# Altium schematic sheet Stm32.SchDoc
size A4; SheetNumber: 2; SheetTotal: 8
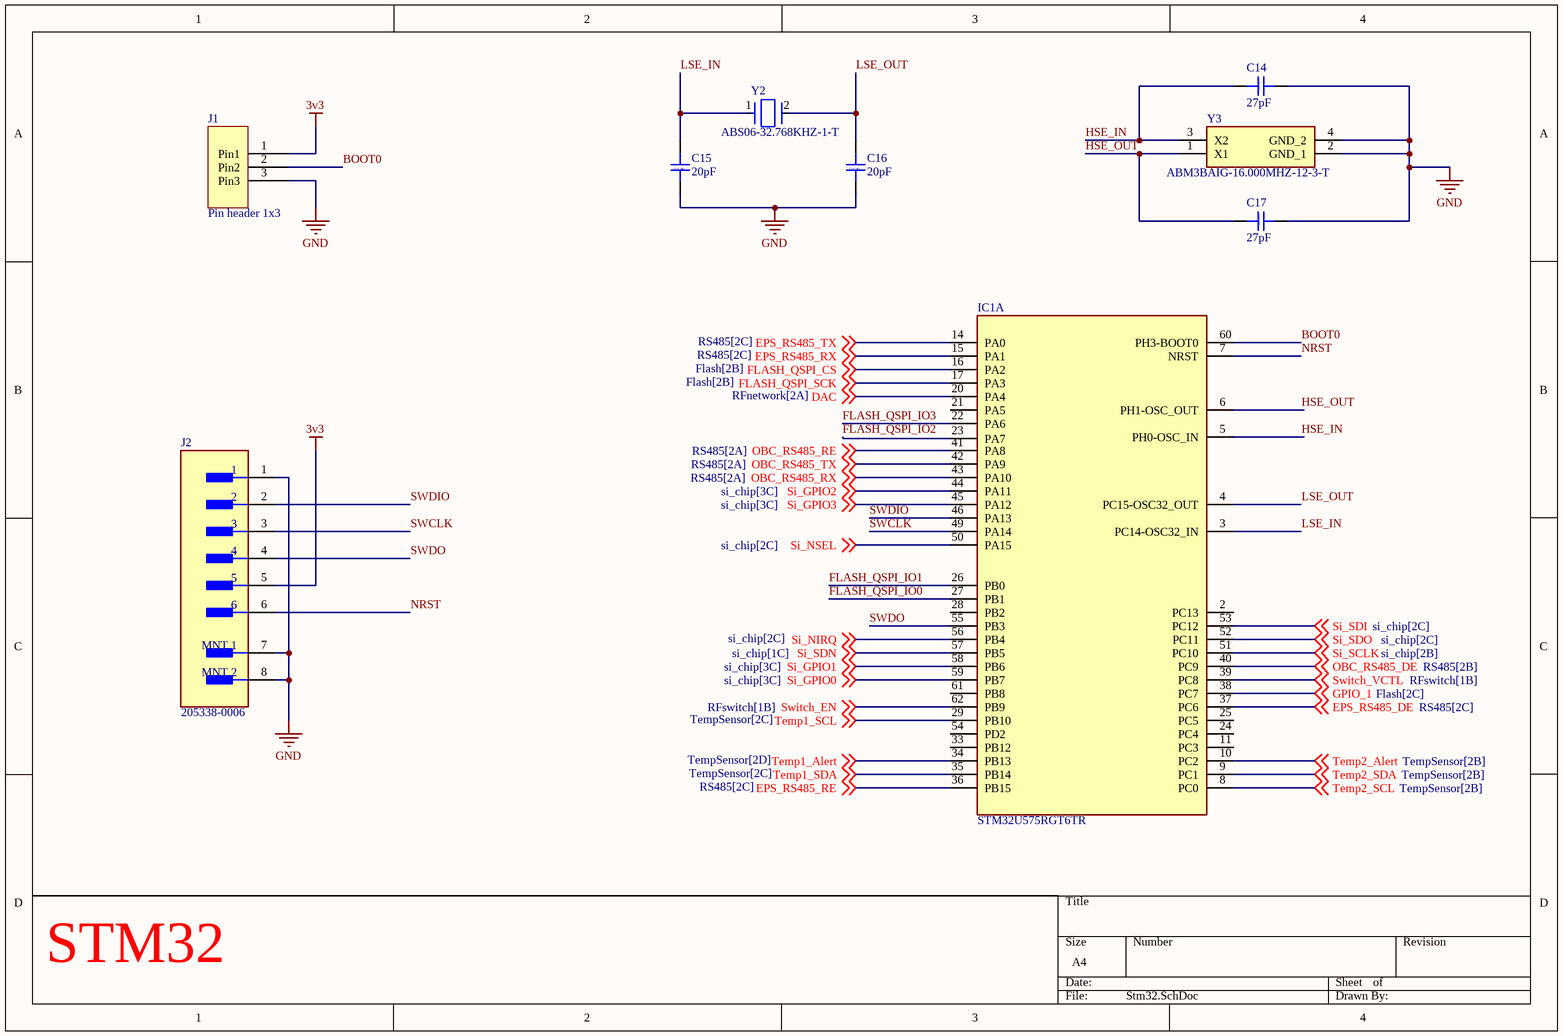
[diagram p0: Stm32.SchDoc]

## Parts
C14  27pF  [CAP_0603]
C15  20pF  [CAP_0603]
C16  20pF  [CAP_0603]
C17  27pF  [CAP_0603]
IC1  STM32U575RGT6TR  [QFP50P1200X1200X160-64N]  (part A of 2)
J1  Pin header 1x3  [HEADER 3]
J2  205338-0006  [FP-2053380006-MFG]
Y2  ABS06-32.768KHZ-1-T  [FP-ABS06-MFG]
Y3  ABM3BAIG-16.000MHZ-12-3-T  [ABM3BAIG]

## Nets
3v3: J1.1(Pin1) J2.5
GND: C14.2 C15.1 C16.1 C17.2 J1.3(Pin3) J2.1 J2.7(MNT_1) J2.8(MNT_2) Y3.2(GND_1) Y3.4(GND_2)
BOOT0: IC1.60(PH3-BOOT0) J1.2(Pin2)
DAC: IC1.20(PA4) ; off-sheet DAC
EPS_RS485_DE: IC1.37(PC6) ; off-sheet EPS_RS485_DE
EPS_RS485_RE: IC1.36(PB15) ; off-sheet EPS_RS485_RE
EPS_RS485_RX: IC1.15(PA1) ; off-sheet EPS_RS485_RX
EPS_RS485_TX: IC1.14(PA0) ; off-sheet EPS_RS485_TX
FLASH_QSPI_CS: IC1.16(PA2) ; off-sheet FLASH_QSPI_CS
FLASH_QSPI_IO0: IC1.27(PB1)
FLASH_QSPI_IO1: IC1.26(PB0)
FLASH_QSPI_IO2: IC1.23(PA7)
FLASH_QSPI_IO3: IC1.22(PA6)
FLASH_QSPI_SCK: IC1.17(PA3) ; off-sheet FLASH_QSPI_SCK
GPIO_1: IC1.38(PC7) ; off-sheet GPIO_1
HSE_IN: C14.1 IC1.5(PH0-OSC_IN) Y3.3(X2)
HSE_OUT: C17.1 IC1.6(PH1-OSC_OUT) Y3.1(X1)
LSE_IN: C15.2 IC1.3(PC14-OSC32_IN) Y2.1
LSE_OUT: C16.2 IC1.4(PC15-OSC32_OUT) Y2.2
NRST: IC1.7(NRST) J2.6
OBC_RS485_DE: IC1.40(PC9) ; off-sheet OBC_RS485_DE
OBC_RS485_RE: IC1.41(PA8) ; off-sheet OBC_RS485_RE
OBC_RS485_RX: IC1.43(PA10) ; off-sheet OBC_RS485_RX
OBC_RS485_TX: IC1.42(PA9) ; off-sheet OBC_RS485_TX
Si_GPIO0: IC1.59(PB7) ; off-sheet Si_GPIO0
Si_GPIO1: IC1.58(PB6) ; off-sheet Si_GPIO1
Si_GPIO2: IC1.44(PA11) ; off-sheet Si_GPIO2
Si_GPIO3: IC1.45(PA12) ; off-sheet Si_GPIO3
Si_NIRQ: IC1.56(PB4) ; off-sheet Si_NIRQ
Si_NSEL: IC1.50(PA15) ; off-sheet Si_NSEL
Si_SCLK: IC1.51(PC10) ; off-sheet Si_SCLK
Si_SDI: IC1.53(PC12) ; off-sheet Si_SDI
Si_SDN: IC1.57(PB5) ; off-sheet Si_SDN
Si_SDO: IC1.52(PC11) ; off-sheet Si_SDO
SWCLK: IC1.49(PA14) J2.3
SWDIO: IC1.46(PA13) J2.2
SWDO: IC1.55(PB3) J2.4
Switch_EN: IC1.62(PB9) ; off-sheet Switch_EN
Switch_VCTL: IC1.39(PC8) ; off-sheet Switch_VCTL
Temp1_Alert: IC1.34(PB13) ; off-sheet Temp1_Alert
Temp1_SCL: IC1.29(PB10) ; off-sheet Temp1_SCL
Temp1_SDA: IC1.35(PB14) ; off-sheet Temp1_SDA
Temp2_Alert: IC1.10(PC2) ; off-sheet Temp2_Alert
Temp2_SCL: IC1.8(PC0) ; off-sheet Temp2_SCL
Temp2_SDA: IC1.9(PC1) ; off-sheet Temp2_SDA

Not connected (* = marked no-connect by the designer): IC1 2(PC13) 11(PC3) 21(PA5) 24(PC4) 25(PC5) 28(PB2) 33(PB12) 54(PD2) 61(PB8)

## Notes on the sheet
- STM32
- (in symbol Capacitor-SMD-0603) SMD 0603

## Library data of the parts
C14-C17 = Capacitor-SMD-0603: Capacitor SMD 0603 RATED
IC1 = STM32U575RGT6TR: Integrated Circuit; Manufacturer_Name: STMicroelectronics; Datasheet Link: https://www.st.com/resource/en/datasheet/stm32u575ag.pdf; Height: 1.6mm; Manufacturer_Part_Number: STM32U575RGT6TR; Mouser Part Number: 511-STM32U575RGT6TR; Mouser Price/Stock: https://www.mouser.co.uk/ProductDetail/STMicroelectronics/STM32U575RGT6TR?qs=T%252BzbugeAwjjwoz%252BinJLUwQ%3D%3D; Arrow Part Number: STM32U575RGT6TR; Arrow Price/Stock: https://www.arrow.com/en/products/stm32u575rgt6tr/stmicroelectronics?utm_currency=USD&region=nac
J2 = CMP-00257-108204701-1: 205338-0006 Connector Shrouded Header Positive Lock 6 Position 2mm Pitch Right Angle Surface Mount T/R; Manufacturer Lifecycle Status: ACTIVE; Number of Circuits: 6; Gender: Male; NexarPartId: 108204701; Contact Plating: Gold; Lifecycle Status: Production; Schedule B: 8536694040; RoHS: Compliant; Number of Rows: 1; Country of Origin: MY; Orientation: Right Angle
Y2 = CMP-27762-012387-2: CRYSTAL 32.7680KHZ 12.5PF SMD; Series Resistance: 90kR; Frequency Tolerance: 10ppm; Number of Pins: 2; Max Operating Temperature: 85°C; Load Capacitance: 12.5pF; Series: ABS06; Depth: 1.2mm; Height: 0.6mm; Min Operating Temperature: -40°C; Mount: Surface Mount; Lead Free: Lead Free; Width: 1.2mm; Frequency: 32.768kHz; ESR (Equivalent Series Resistance): 90kR; Termination: SMD/SMT; Packaging: Tape and Reel; RoHS Compliant: Yes; REACH SVHC: No SVHC; Operating Frequency: 32.768 kHz; Case/Package: CSMD; Package Quantity: 3000; Radiation Hardening: No; Tolerance: 10ppm; Length: 2mm
Y3 = ABM3BAIG-16.000MHZ-12-3-T: Crystal or Oscillator; Manufacturer_Name: ABRACON; Datasheet Link: https://abracon.com/AIGcrystals/ABM3BAIG.pdf; Height: 0.9mm; Manufacturer_Part_Number: ABM3BAIG-16.000MHZ-12-3-T